# EAGLE schematic esquemático (EAGLE 8.5.0)
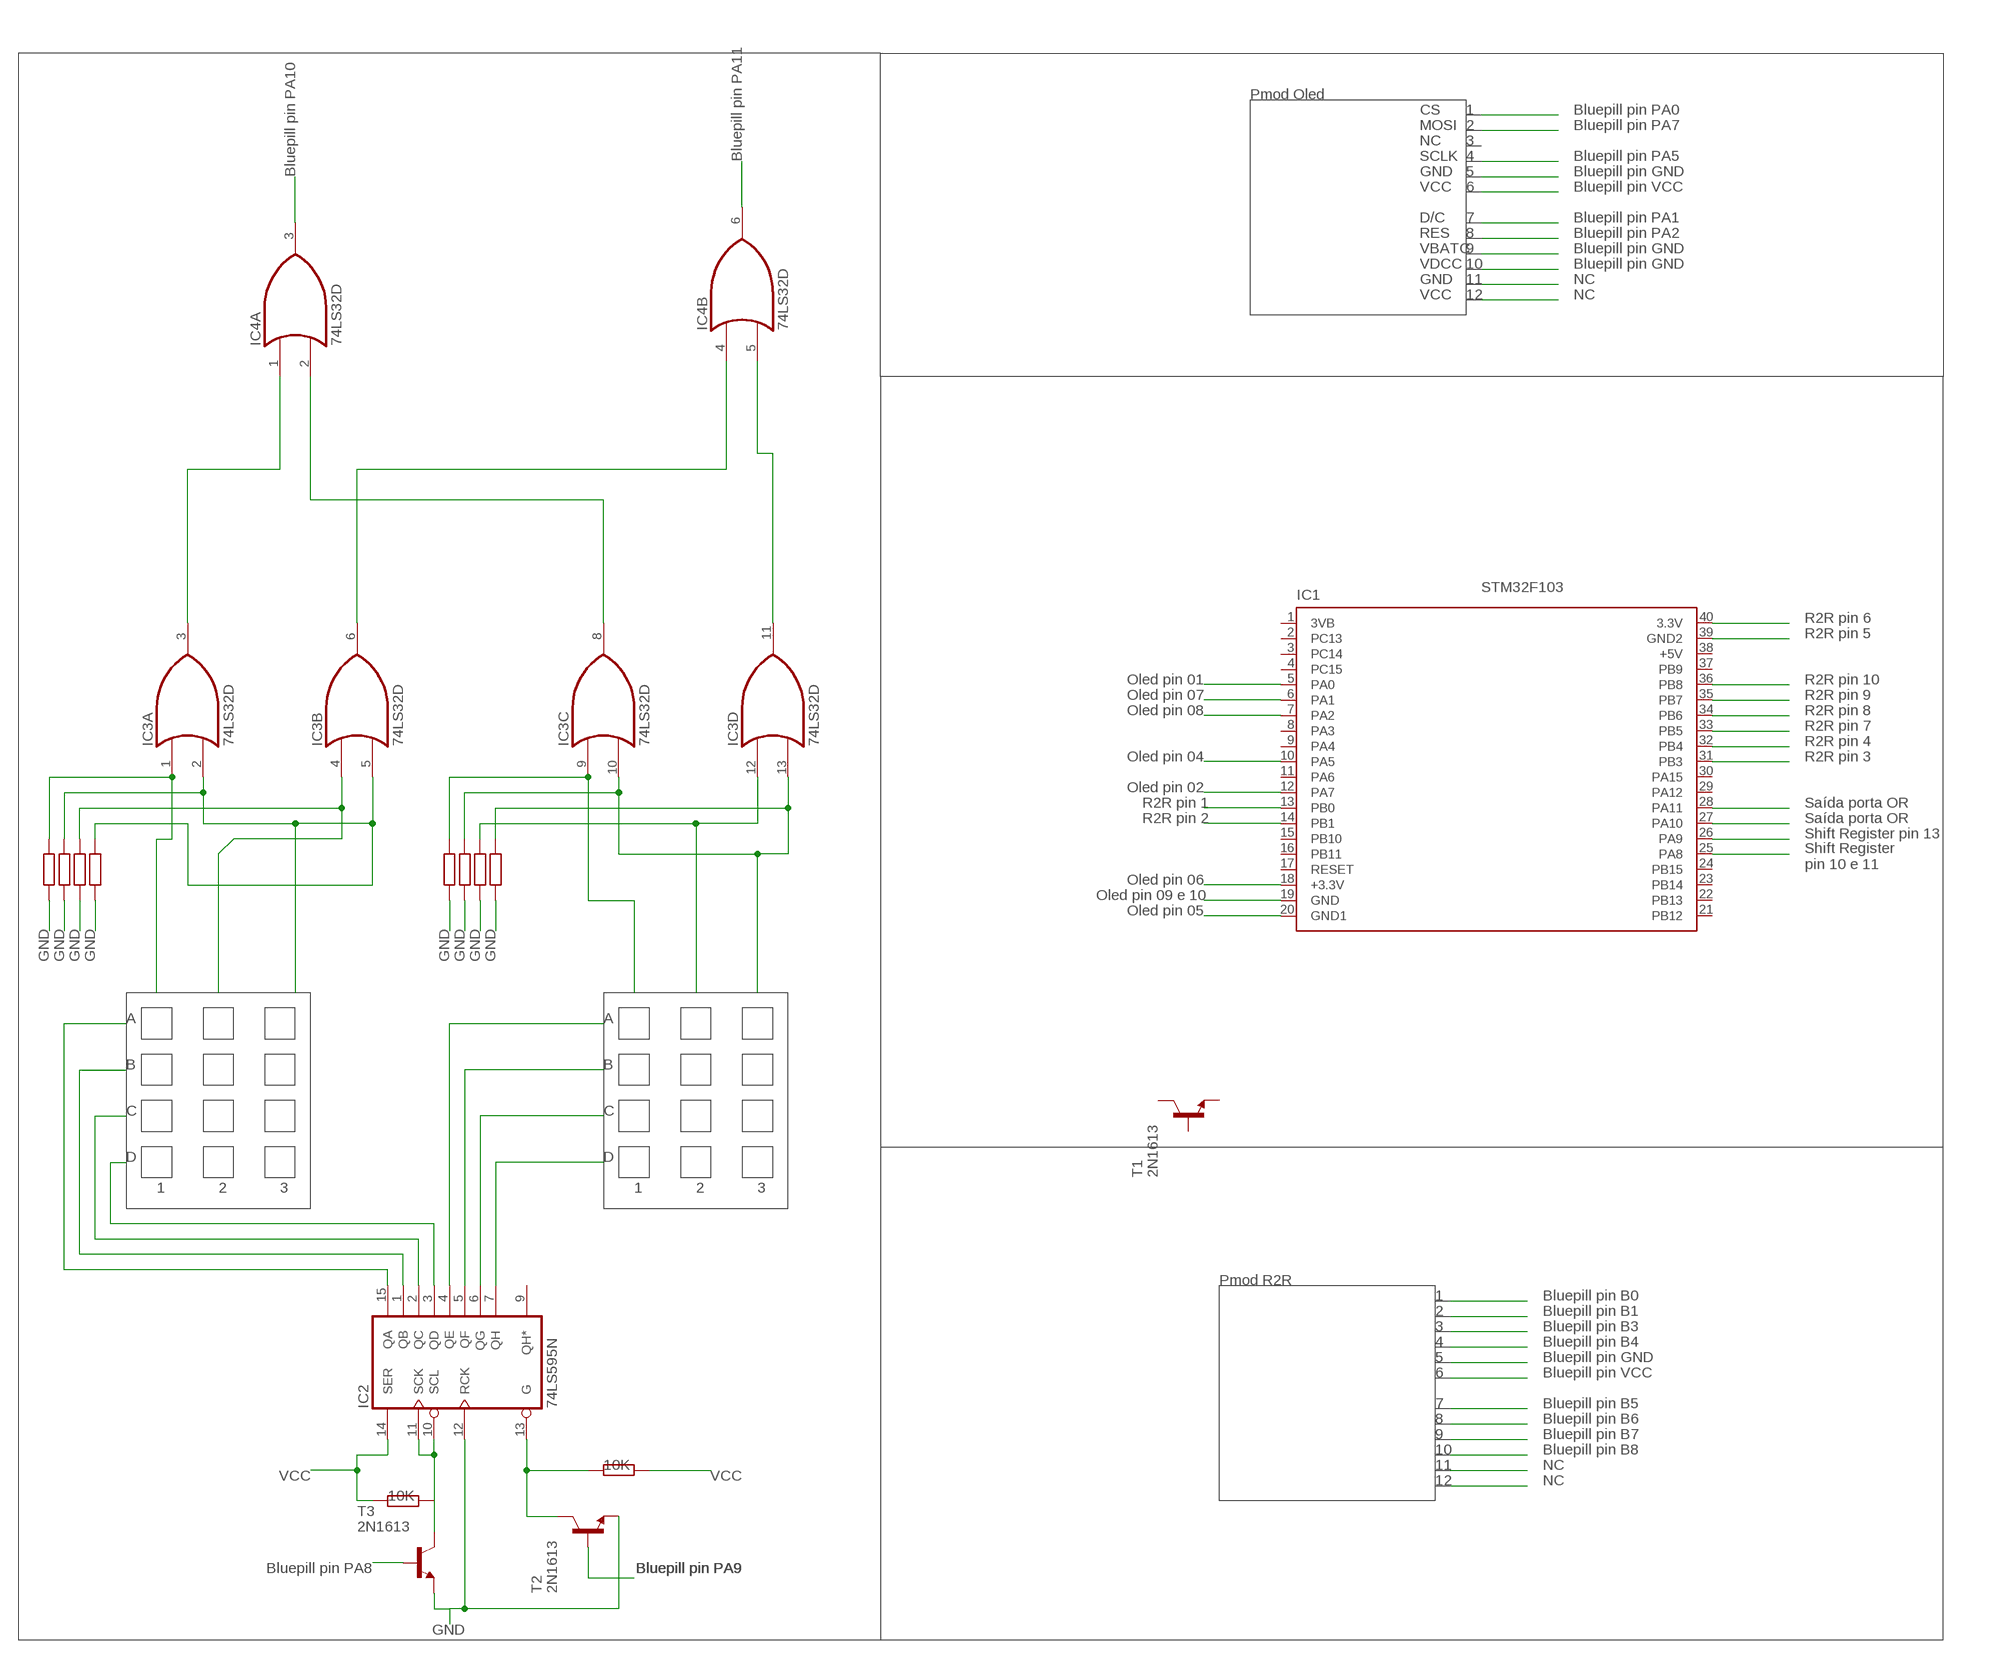
[diagram p0: schematic, sheet 1]

## Parts
IC1  BLUEPILL455  [DIL40]
IC2  74LS595N  [DIL16]
IC3  74LS32D  [SO14]
IC4  74LS32D  [SO14]
T1  2N1613  [TO5]
T2  2N1613  [TO5]
T3  2N1613  [TO5]

## Nets
N$1: IC1.5(PA0)
N$2: IC1.12(PA7)
N$3: IC1.10(PA5)
N$4: IC1.19(GND)
N$5: IC1.18(+3.3V)
N$6: IC1.6(PA1)
N$7: IC1.7(PA2)
N$8: IC1.20(GND1)
N$20: IC2.15(QA)
N$21: IC2.1(QB)
N$22: IC2.2(QC)
N$23: IC2.3(QD)
N$24: IC2.4(QE)
N$25: IC2.5(QF)
N$26: IC2.6(QG)
N$27: IC2.7(QH)
N$28: IC3.1(A:I0)
N$29: IC3.4(B:I0)
N$30: IC3.2(A:I1) IC3.5(B:I1)
N$31: IC3.12(D:I0)
N$32: IC1.13(PB0)
N$33: IC1.14(PB1)
N$34: IC1.31(PB3)
N$35: IC1.32(PB4)
N$36: IC1.33(PB5)
N$37: IC1.34(PB6)
N$38: IC1.35(PB7)
N$39: IC1.36(PB8)
N$40: IC1.39(GND2)
N$41: IC1.40(3.3V)
N$54: IC3.9(C:I0)
N$55: IC3.10(C:I1) IC3.13(D:I1)
N$56: IC3.6(B:O) IC4.4(B:I0)
N$57: IC3.11(D:O) IC4.5(B:I1)
N$58: IC3.8(C:O) IC4.2(A:I1)
N$59: IC3.3(A:O) IC4.1(A:I0)
N$60: IC4.3(A:O)
N$61: IC4.6(B:O)
N$62: IC2.10(SCL) IC2.11(SCK) T3.3(C)
N$63: IC2.12(RCK) T2.1(E)
N$64: T3.2(B)
N$65: IC2.13(G) T2.3(C)
N$66: IC2.14(SER)
N$67: IC1.27(PA10)
N$68: IC1.28(PA11)
N$69: IC1.26(PA9)
N$70: IC1.25(PA8)
N$71: T3.1(E)
N$72: T2.2(B)
Unconnected: IC1.1(3VB) IC1.2(PC13) IC1.3(PC14) IC1.4(PC15) IC1.8(PA3) IC1.9(PA4) IC1.15(PB10) IC1.16(PB11) IC1.17(RESET) IC1.21(PB12) IC1.22(PB13) IC1.23(PB14) IC1.24(PB15) IC1.29(PA12) IC1.30(PA15) IC1.37(PB9) IC1.38(+5V) IC2.9(QH*) IC4.8(C:O) IC4.9(C:I0) IC4.10(C:I1) IC4.11(D:O) IC4.12(D:I0) IC4.13(D:I1) T1.1(E) T1.2(B) T1.3(C)

## Notes on the sheet
- Pmod Oled
- CS | 1 | Bluepill pin PA0
- MOSI | 2 | Bluepill pin PA7
- NC | 3
- Bluepill pin PA11 | SCLK | 4 | Bluepill pin PA5
- Bluepill pin PA10 | GND | 5 | Bluepill pin GND
- VCC | 6 | Bluepill pin VCC
- D/C | 7 | Bluepill pin PA1
- RES | 8 | Bluepill pin PA2
- VBATC | 9 | Bluepill pin GND
- VDCC | 10 | Bluepill pin GND
- GND | 11 | NC
- VCC | 12 | NC
- STM32F103
- R2R pin 6
- R2R pin 5
- Oled pin 01 | R2R pin 10
- Oled pin 07 | R2R pin 9
- Oled pin 08 | R2R pin 8
- R2R pin 7
- R2R pin 4
- Oled pin 04 | R2R pin 3
- Oled pin 02
- R2R pin 1 | Saída porta OR
- R2R pin 2 | Saída porta OR
- Shift Register pin 13
- Shift Register 
  pin 10 e 11
- Oled pin 06
- Oled pin 09 e 10
- Oled pin 05
- GND | GND | GND | GND | GND | GND | GND | GND
- A | A
- B | B
- C | C
- D | D
- 1 | 2 | 3 | 1 | 2 | 3
- Pmod R2R
- 1 | Bluepill pin B0
- 2 | Bluepill pin B1
- 3 | Bluepill pin B3
- 4 | Bluepill pin B4
- 5 | Bluepill pin GND
- 6 | Bluepill pin VCC
- 7 | Bluepill pin B5
- 8 | Bluepill pin B6
- 9 | Bluepill pin B7
- 10 | Bluepill pin B8
- VCC | 10K | VCC | 11 | NC
- 12 | NC
- 10K
- Bluepill pin PA8 | Bluepill pin PA9 | Bluepill pin PA9 | Bluepill pin PA9
- GND

## Power pins joined to a net without a drawn wire
GND: IC2.8(GND) IC3.7(P:GND) IC4.7(P:GND)
PA6: IC1.11(PA6)
VCC: IC2.16(VCC) IC3.14(P:VCC) IC4.14(P:VCC)

## Library data of the parts
IC1 = STM32BluePill:BLUEPILL: BluePill STM32F108T6 Dev Board Source: http://www.stm32duino.com; 0: x; MF: BluePill; MPN: BluePill; X: 0
IC2 = 74xx-eu:74*595: 8-bit SHIFT REGISTER, output latch
IC3 IC4 = 74xx-us:74*32: Quad 2-input OR gate
T1-T3 = transistor:2N1613: NPN TRANSISTOR